# Altium schematic sheet raspi.SchDoc
size A4
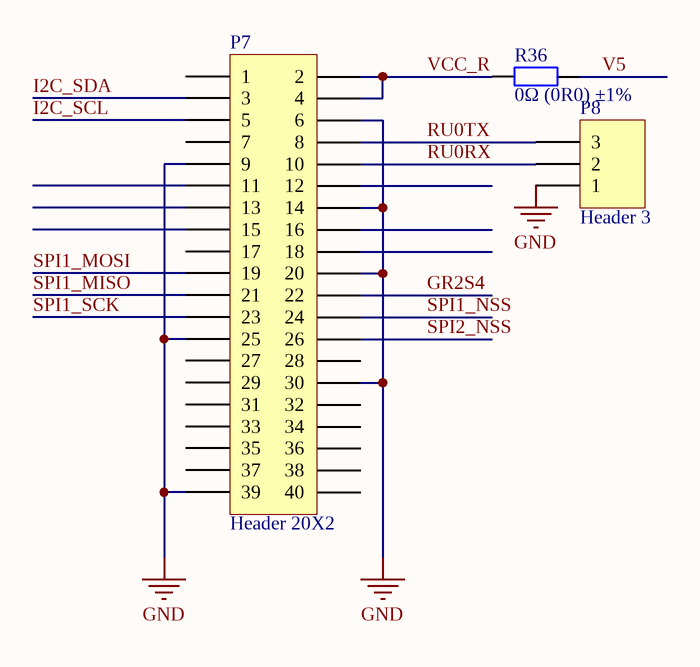
[diagram p0: raspi.SchDoc]

## Parts
P7  Header 20X2  [HDR2X20]
P8  Header 3  [HDR1X3]
R36  0Ω (0R0) ±1%  [1206_R]

## Nets
GND: P7.6 P7.9 P7.14 P7.20 P7.25 P7.30 P7.39 P8.1
GR2S4: P7.22
I2C_SCL: P7.5
I2C_SDA: P7.3
RU0RX: P7.10 P8.2
RU0TX: P7.8 P8.3
SPI1_MISO: P7.21
SPI1_MOSI: P7.19
SPI1_NSS: P7.24
SPI1_SCK: P7.23
SPI2_NSS: P7.26
V5: R36.2
VCC_R: P7.2 P7.4 R36.1

Not connected (* = marked no-connect by the designer): P7 1 7 11 12 13 15 16 17 18 27 28 29 31 32 33 34 35 36 37 38 40

## Library data of the parts
P7 = Header 20X2: Header, 20-Pin, Dual row; LatestRevisionDate: 17-Jul-2002; LatestRevisionNote: Re-released for DXP Platform.; Publisher: Altium Limited
P8 = Header 3: Header, 3-Pin; LatestRevisionDate: 17-Jul-2002; LatestRevisionNote: Re-released for DXP Platform.; Publisher: Altium Limited
R36 = 1206 0Ω (0R0) 1%: 贴片电阻; ComponentLink1Description: 供应商链接; ComponentLink1URL: http://www.szlcsc.com/product/details_18576.html; Package: 1206; Supplier: LC; SuppliersPartNumber: C17888